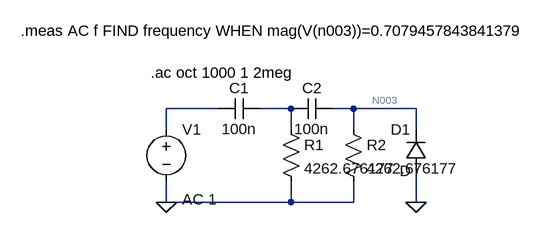
[diagram p0: schematic hpf_2st_ord_1khz_cutoff.asc]
hpf_2st_ord_1khz_cutoff.asc, the LTspice schematic file:
Version 4.1
SHEET 1 880 680
WIRE 144 96 64 96
WIRE 256 96 208 96
WIRE 352 96 320 96
WIRE 448 96 352 96
WIRE 64 128 64 96
WIRE 256 128 256 96
WIRE 352 128 352 96
WIRE 448 128 448 96
WIRE 64 240 64 208
WIRE 256 240 256 208
WIRE 256 240 64 240
WIRE 352 240 352 208
WIRE 352 240 256 240
WIRE 448 240 448 192
FLAG 64 240 0
FLAG 448 240 0
SYMBOL voltage 64 112 R0
WINDOW 3 24 152 Left 2
WINDOW 123 24 124 Left 2
WINDOW 39 0 0 Left 0
SYMATTR Value ""
SYMATTR Value2 AC 1
SYMATTR InstName V1
SYMBOL cap 208 80 R90
WINDOW 0 0 32 VBottom 2
WINDOW 3 32 32 VTop 2
SYMATTR InstName C1
SYMATTR Value 100n
SYMBOL cap 320 80 R90
WINDOW 0 0 32 VBottom 2
WINDOW 3 32 32 VTop 2
SYMATTR InstName C2
SYMATTR Value 100n
SYMBOL res 240 112 R0
SYMATTR InstName R1
SYMATTR Value 4262.676177
SYMBOL res 336 112 R0
SYMATTR InstName R2
SYMATTR Value 4262.676177
SYMBOL diode 464 192 R180
WINDOW 0 24 64 Left 2
WINDOW 3 24 0 Left 2
SYMATTR InstName D1
TEXT 40 40 Left 2 !.ac oct 1000 1 2meg
TEXT -160 -24 Left 2 !.meas AC f FIND frequency WHEN mag(V(n003))=0.7079457843841379

The netlist it stands for:
* hpf_2st_ord_1khz_cutoff.asc
V1 N001 0 AC 1
C1 N002 N001 100n
C2 N003 N002 100n
R1 N002 0 4262.676177
R2 N003 0 4262.676177
D1 0 N003 D
.model D D
.lib standard.dio
.ac oct 1000 1 2meg
.meas AC f FIND frequency WHEN mag(V(n003))=0.7079457843841379
.backanno
.end